# Altium schematic sheet Resistor - 215-258.SchDoc
size A0; SheetNumber: 6; SheetTotal: 41
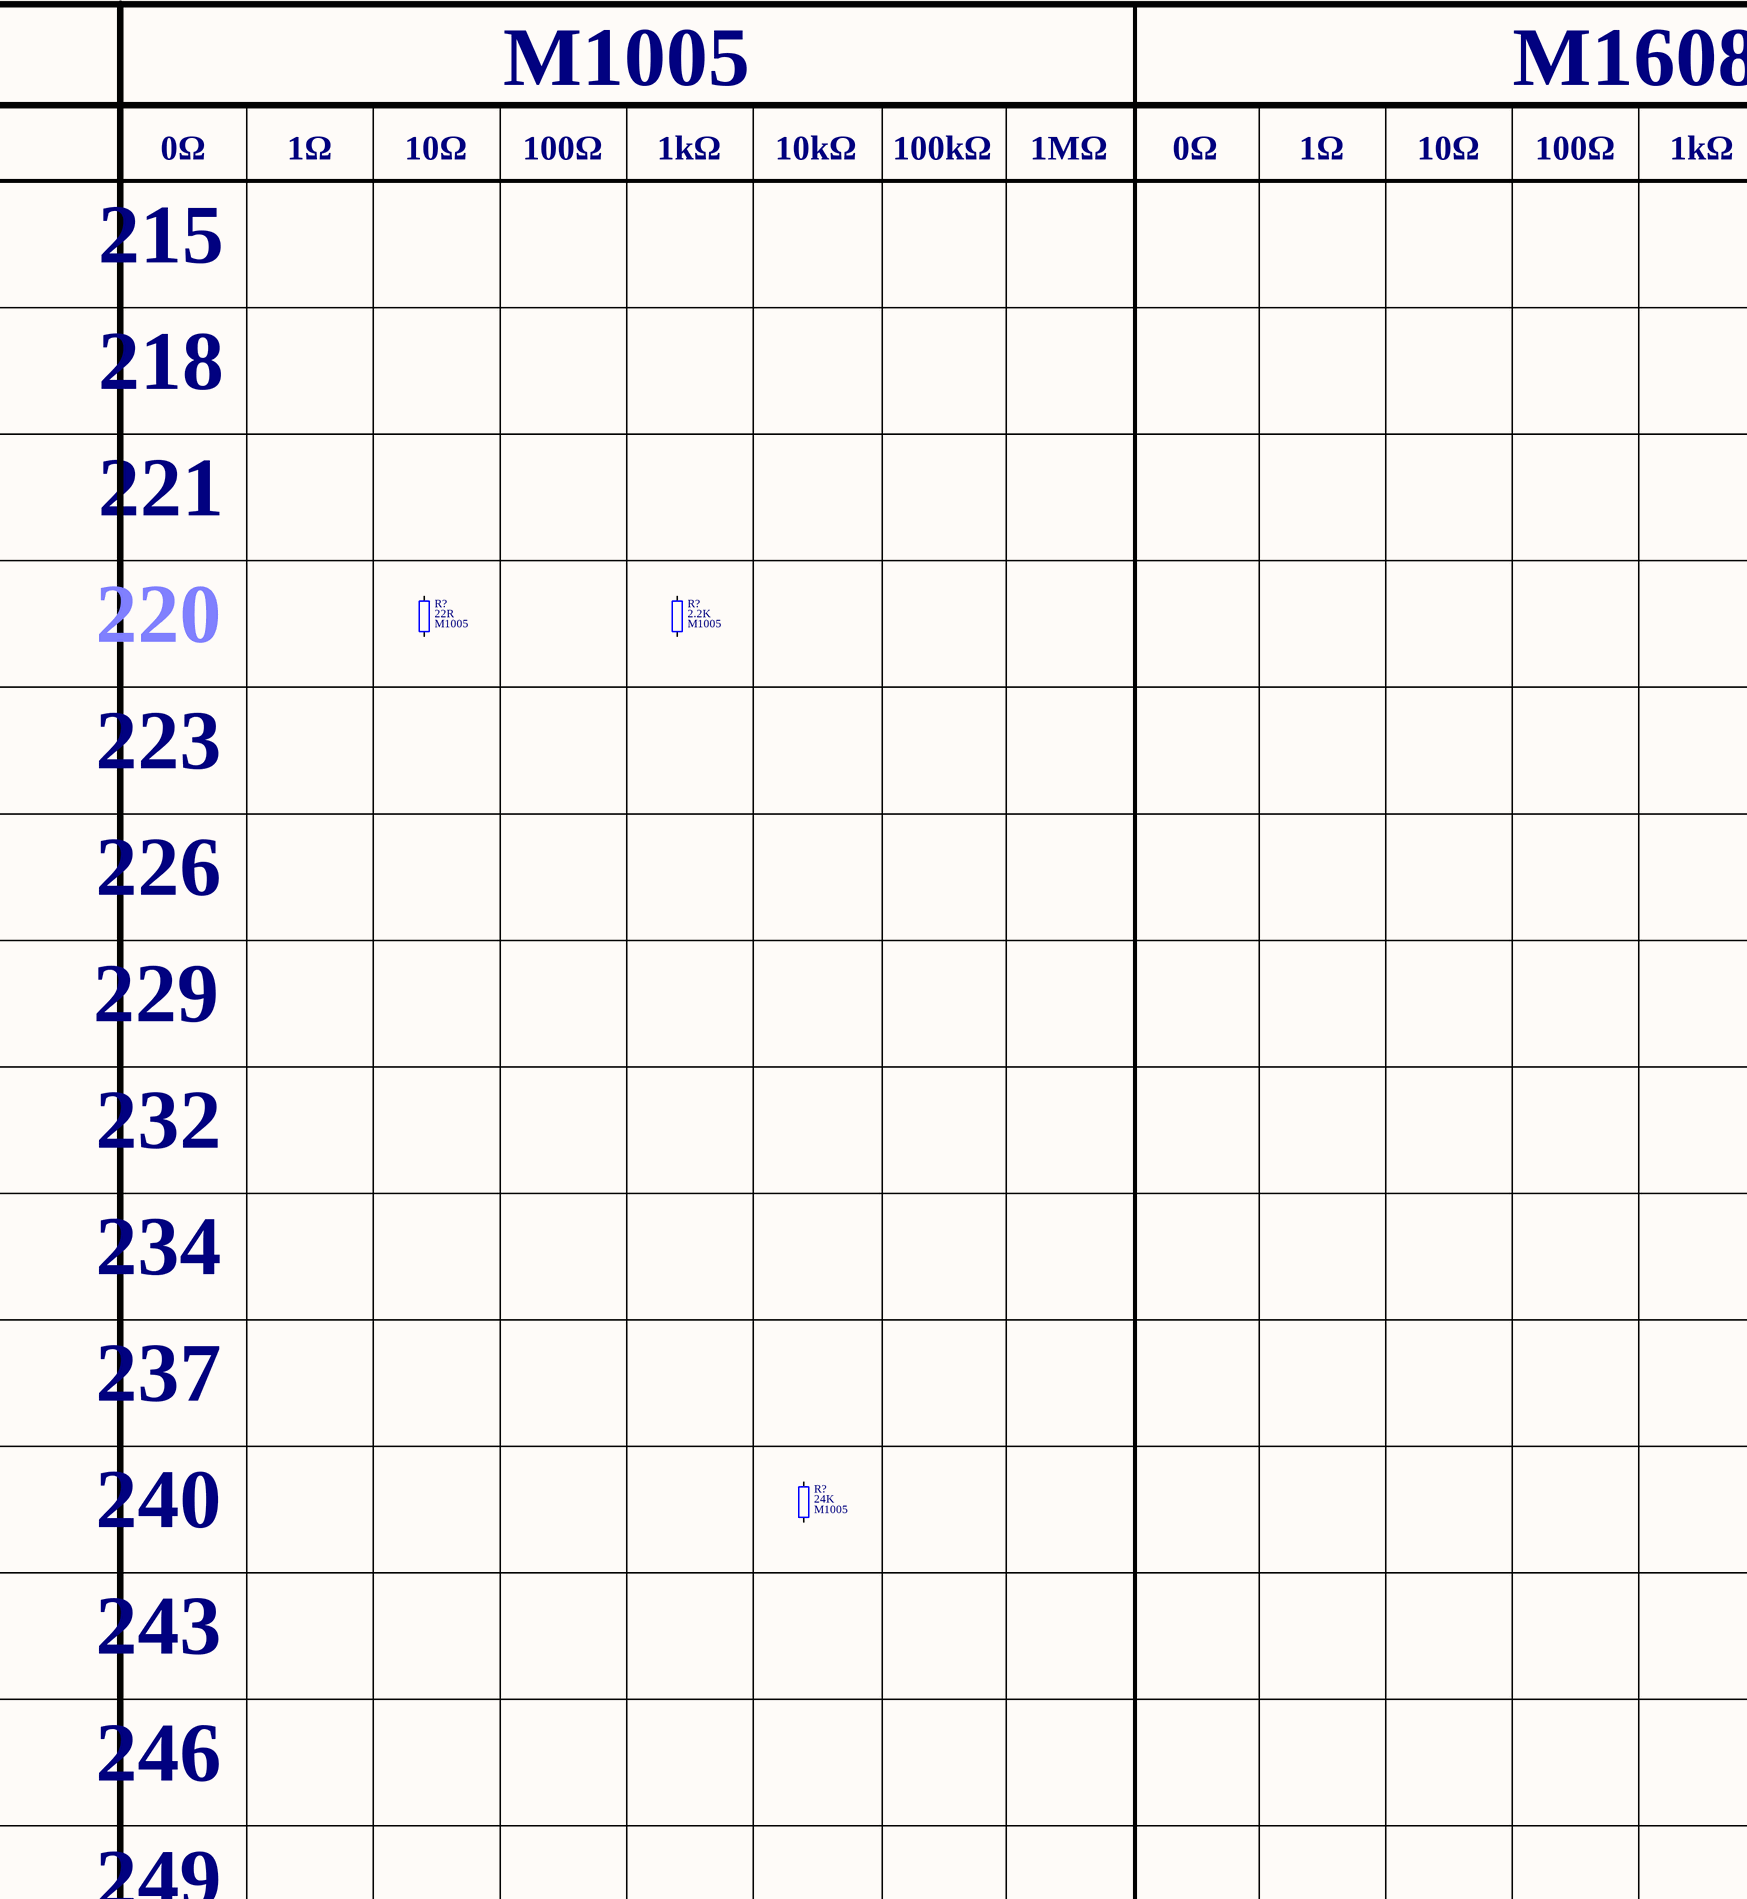
[diagram p0: Resistor - 215-258.SchDoc, top left]
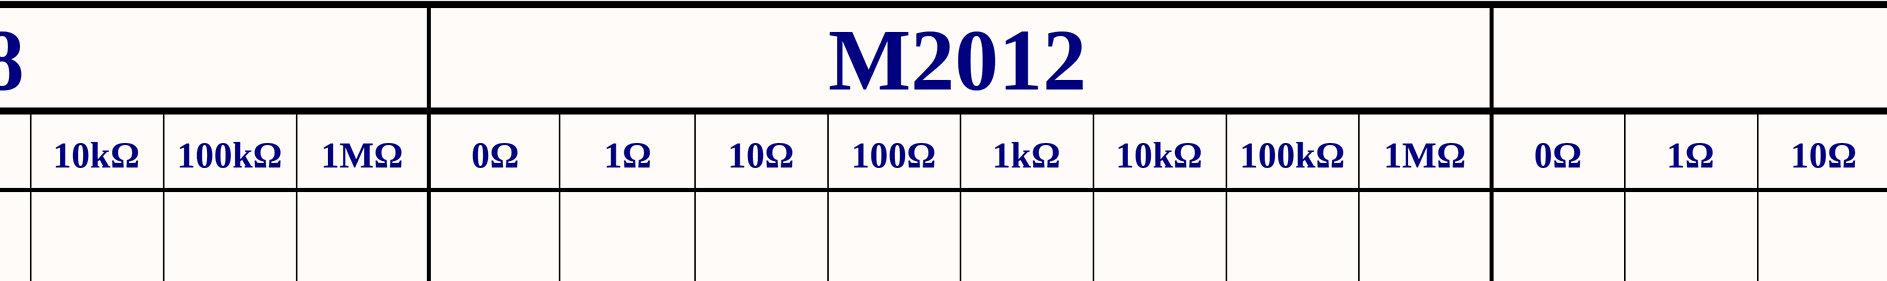
[diagram p1: Resistor - 215-258.SchDoc, top middle]
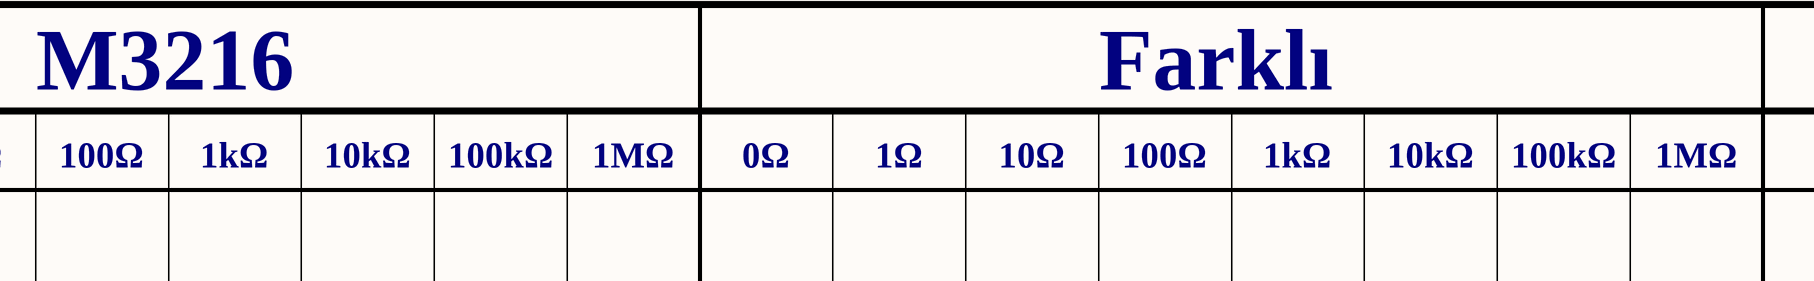
[diagram p2: Resistor - 215-258.SchDoc, top right]
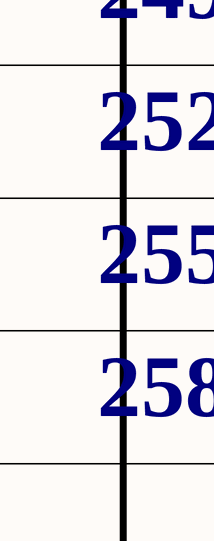
[diagram p3: Resistor - 215-258.SchDoc, bottom left]

## Parts
(Parts that share a designator on the sheet are numbered #1, #2 ... from top to bottom, then left to right.)
R?#1  value 22R  Package: M1005  [Resistor_Smd_M1005_I0402]  (hidden comment: Resistor)
R?#2  value 2.2K  Package: M1005  [Resistor_Smd_M1005_I0402]  (hidden comment: Resistor)
R?#3  value 24K  Package: M1005  [Resistor_Smd_M1005_I0402]  (hidden comment: Resistor)

## Nets

Not connected (* = marked no-connect by the designer): R?#1 1 2; R?#2 1 2; R?#3 1 2

## Notes on the sheet
- M1005
- M1608
- M2012
- M3216
- Farklı
- 0Ω
- 1Ω
- 10Ω
- 100Ω
- 1kΩ
- 10kΩ
- 100kΩ
- 1MΩ
- 215
- 218
- 221
- 220
- 223
- 226
- 229
- 232
- 234
- 237
- 240
- 243
- 246
- 249
- 252
- 255
- 258

## Library data of the parts
R?#1 = Resistor: Res, 22R, 1%, M1005; Manufacturer: Yageo; Manufacturer Part Number: RC0402FR-0722RL; Component Category: Resistor; Component Type: Fixed Value; Tolerance: 1%; Supplier Link: https://www.digikey.com/en/products/detail/yageo/RC0402FR-0722RL/726562; Supplier Currency: $; Price, Max: 0.00129; Price, Min: 0.1; Quantity, Max: 100000; Quantity, Min: 1; Operating Temperature, Max: -55℃; Operating Temperature, Min: +155℃; Supplier Part Number: 311-22.0LRCT-ND; Supplier: Digikey; ComponentLink1Description: Datasheet; ComponentLink1URL: E:\Altium\Datasheets\Resistor\Yageo - RC_L Series.pdf; ComponentLink2Description: Supplier Link; ComponentLink2URL: https://www.digikey.com/en/products/detail/yageo/RC0402FR-0722RL/726562
R?#2 = Resistor: Res, 2.2K, 1%, M1005; Manufacturer: Yageo; Manufacturer Part Number: RC0402FR-072K2L; Component Category: Resistor; Component Type: Fixed Value; Tolerance: 1%; Supplier Link: https://www.digikey.com/en/products/detail/yageo/RC0402FR-072K2L/726553; Supplier Currency: $; Price, Max: 0.00129; Price, Min: 0.1; Quantity, Max: 100000; Quantity, Min: 1; Operating Temperature, Max: -55℃; Operating Temperature, Min: +155℃; Supplier Part Number: 311-2.20KLRCT-ND; Supplier: Digikey; ComponentLink1Description: Datasheet; ComponentLink1URL: E:\Altium\Datasheets\Resistor\Yageo - RC_L Series.pdf; ComponentLink2Description: Supplier Link; ComponentLink2URL: https://www.digikey.com/en/products/detail/yageo/RC0402FR-072K2L/726553
R?#3 = Resistor: Res, 24K, 1%, M1005; Manufacturer: Yageo; Manufacturer Part Number: RC0402FR-0724KL; Component Category: Resistor; Component Type: Fixed Value; Tolerance: 1%; Supplier Link: https://www.digikey.com/en/products/detail/yageo/RC0402FR-0724KL/2827581; Supplier Currency: $; Price, Max: 0.00129; Price, Min: 0.1; Quantity, Max: 100000; Quantity, Min: 1; Operating Temperature, Max: -55℃; Operating Temperature, Min: +155℃; Supplier Part Number: 311-24KLRCT-ND; Supplier: Digikey; ComponentLink1Description: Datasheet; ComponentLink1URL: E:\Altium\Datasheets\Resistor\Yageo - RC_L Series.pdf; ComponentLink2Description: Supplier Link; ComponentLink2URL: https://www.digikey.com/en/products/detail/yageo/RC0402FR-0724KL/2827581